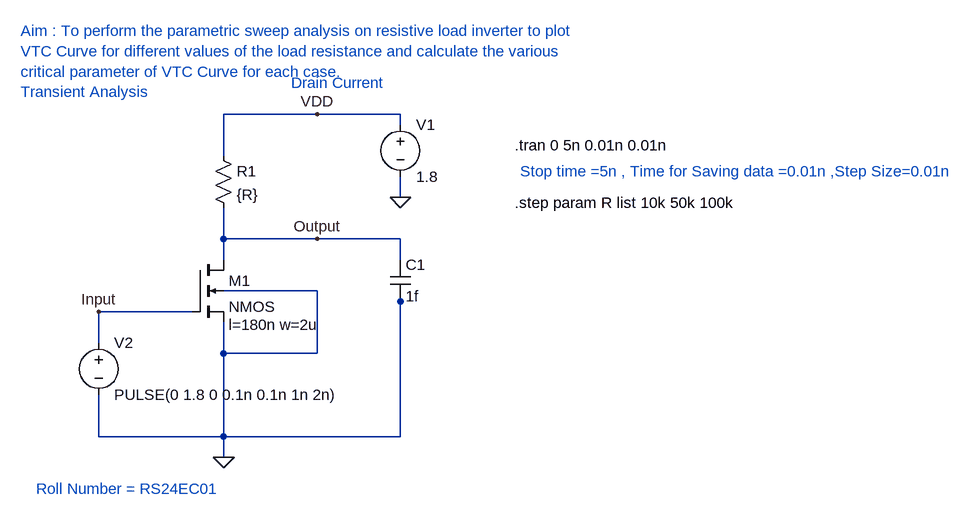
[diagram p0: schematic Exp1 VTC_Resistive_Inverter.TransientAnalysisDrainCurrent.asc]
Exp1 VTC_Resistive_Inverter.TransientAnalysisDrainCurrent.asc, the LTspice schematic file:
Version 4
SHEET 1 1584 680
WIRE 448 -112 304 -112
WIRE 576 -112 448 -112
WIRE 576 -96 576 -112
WIRE 304 -48 304 -112
WIRE 576 16 576 -16
WIRE 304 80 304 32
WIRE 448 80 304 80
WIRE 576 80 448 80
WIRE 304 112 304 80
WIRE 576 112 576 80
WIRE 448 160 304 160
WIRE 576 176 576 160
WIRE 256 192 112 192
WIRE 112 240 112 192
WIRE 304 256 304 208
WIRE 448 256 448 160
WIRE 448 256 304 256
WIRE 112 384 112 320
WIRE 304 384 304 256
WIRE 304 384 112 384
WIRE 576 384 576 176
WIRE 576 384 304 384
WIRE 304 416 304 384
FLAG 576 16 0
FLAG 304 416 0
FLAG 112 192 Input
FLAG 448 80 Output
FLAG 448 -112 VDD
SYMBOL res 288 -64 R0
SYMATTR InstName R1
SYMATTR Value {R}
SYMBOL cap 560 112 R0
SYMATTR InstName C1
SYMATTR Value 1f
SYMBOL voltage 576 -112 R0
WINDOW 123 0 0 Left 0
WINDOW 39 0 0 Left 0
SYMATTR InstName V1
SYMATTR Value 1.8
SYMBOL voltage 112 224 R0
WINDOW 123 0 0 Left 0
WINDOW 39 0 0 Left 0
SYMATTR InstName V2
SYMATTR Value PULSE(0 1.8 0 0.1n 0.1n 1n 2n)
SYMBOL nmos4 256 112 R0
WINDOW 123 56 100 Left 2
SYMATTR Value2 l=180n w=2u
SYMATTR InstName M1
TEXT -8 -240 Left 2 ;Aim : To perform the parametric sweep analysis on resistive load inverter to plot \nVTC Curve for different values of the load resistance and calculate the various \ncritical parameter of VTC Curve for each case. \nTransient Analysis
TEXT 16 464 Left 2 ;Roll Number = RS24EC01
TEXT 752 -64 Left 2 !.tran 0 5n 0.01n 0.01n
TEXT 760 -24 Left 2 ;Stop time =5n , Time for Saving data =0.01n ,Step Size=0.01n
TEXT 408 -160 Left 2 ;Drain Current
TEXT 752 24 Left 2 !.step param R list 10k 50k 100k

The netlist it stands for:
* Exp1 VTC_Resistive_Inverter.TransientAnalysisDrainCurrent.asc
R1 VDD Output {R}
C1 Output 0 1f
V1 VDD 0 1.8
V2 Input 0 PULSE(0 1.8 0 0.1n 0.1n 1n 2n)
M1 Output Input 0 0 NMOS l=180n w=2u
.model NMOS NMOS
.model PMOS PMOS
.lib standard.mos
* Aim : To perform the parametric sweep analysis on resistive load inverter to plot
* VTC Curve for different values of the load resistance and calculate the various
* critical parameter of VTC Curve for each case.
* Transient Analysis
* Roll Number = RS24EC01
.tran 0 5n 0.01n 0.01n
* Stop time =5n , Time for Saving data =0.01n ,Step Size=0.01n
* Drain Current
.step param R list 10k 50k 100k
.backanno
.end

* Results of the author's LTspice run, read from the files saved beside the schematic
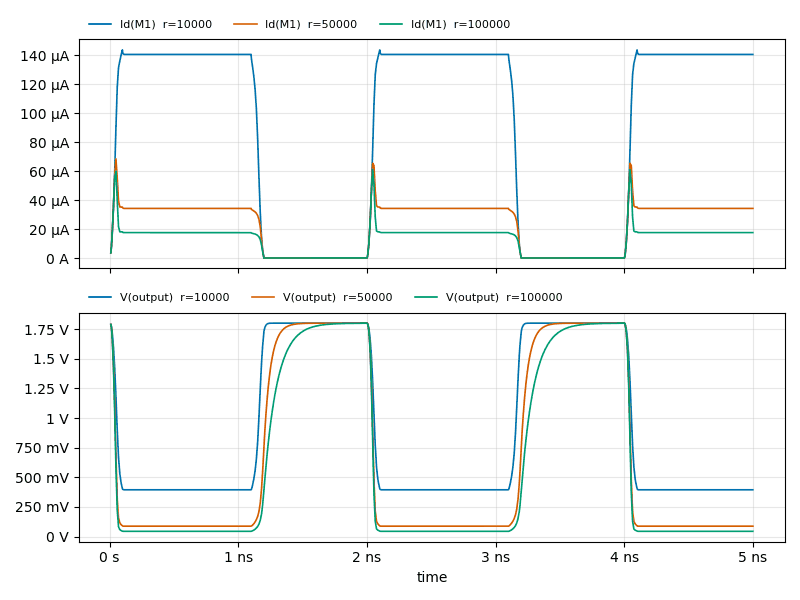
[diagram p1: Transient Analysis of Exp1 VTC_Resistive_Inverter.TransientAnalysisDrainCurrent.asc, plotted from the saved traces]
* Transient Analysis, 3 runs:
*   Id(M1) [r=10000]: min 0 A, max 143.7 µA, average 89.51 µA, rms 111.2 µA, last 140.5 µA
*   Id(M1) [r=50000]: min 0 A, max 68.48 µA, average 23.05 µA, rms 28.5 µA, last 34.24 µA
*   Id(M1) [r=100000]: min 0 A, max 61.17 µA, average 12.38 µA, rms 15.89 µA, last 17.56 µA
*   V(output) [r=10000]: min 394.6 mV, max 1.8 V, average 907.7 mV, rms 1.121 V, last 394.6 mV
*   V(output) [r=50000]: min 87.75 mV, max 1.8 V, average 663.7 mV, rms 1.023 V, last 87.75 mV
*   V(output) [r=100000]: min 44.44 mV, max 1.8 V, average 594.8 mV, rms 968.4 mV, last 44.44 mV